# Altium schematic sheet Sheet1.SchDoc
size A3; SheetNumber: 1; SheetTotal: 1
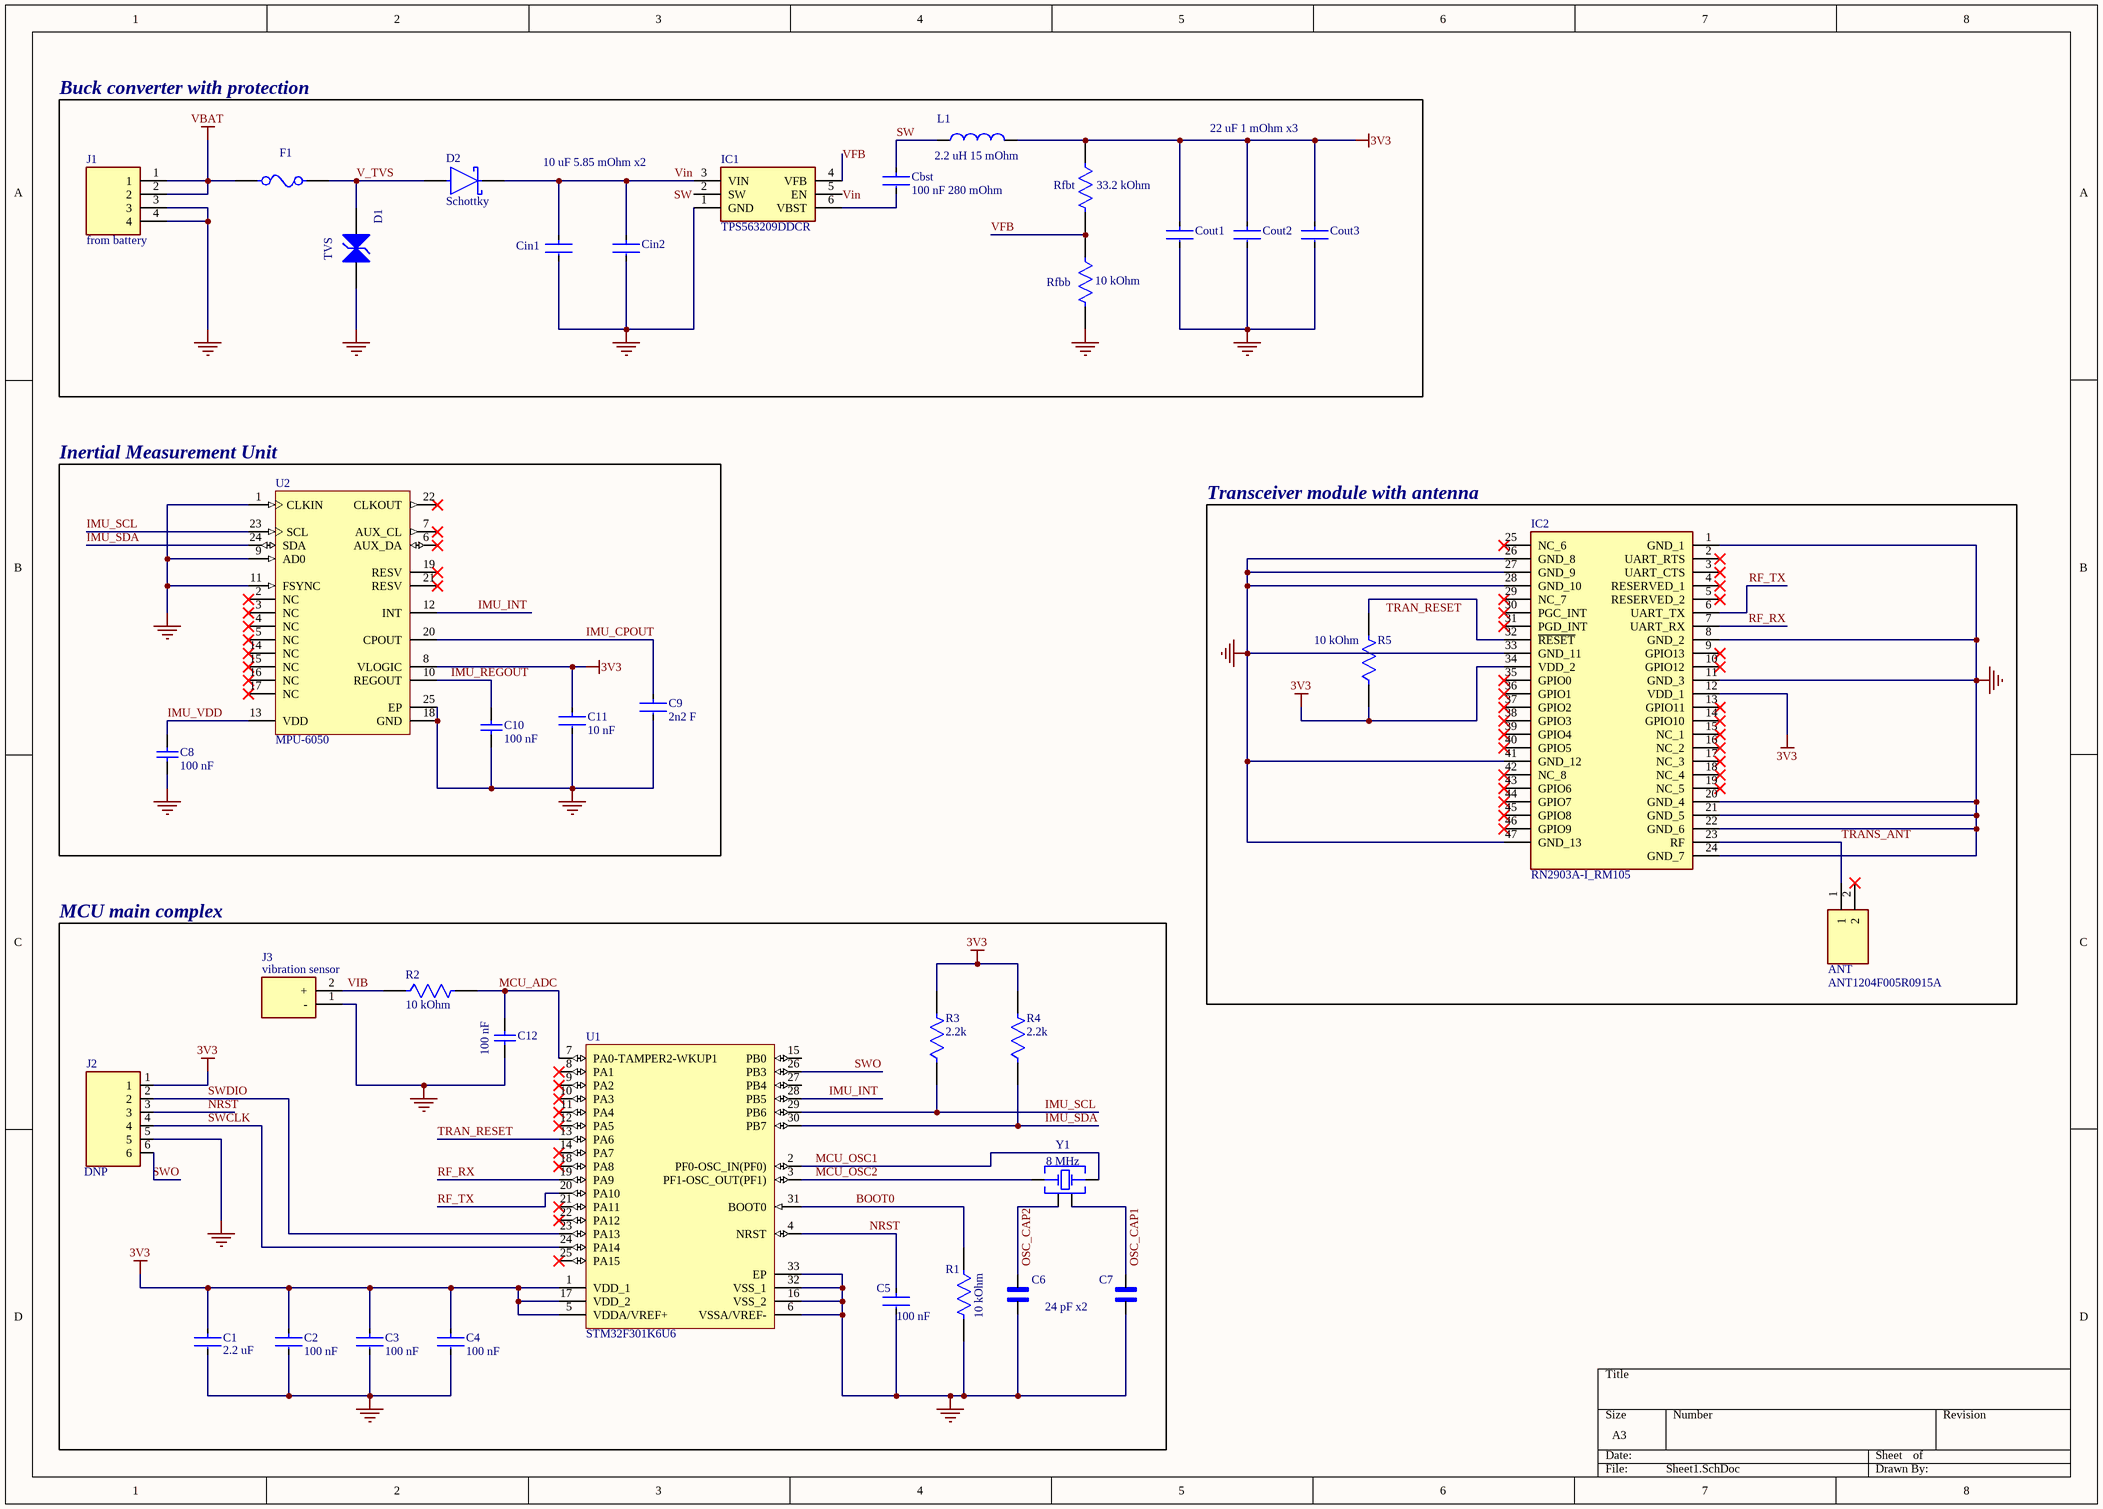
[diagram p0: Sheet1.SchDoc]

## Parts
ANT  ANT1204F005R0915A  [ANT1204F005R0915A]
C1  2.2 uF  [FP-GRM21B-0_2-e0_2_0_7-IPC_B]
C2  100 nF  [FP-GCE21B-0_3-MFG]
C3  100 nF  [FP-GCE21B-0_3-MFG]
C4  100 nF  [FP-GCE21B-0_3-MFG]
C5  100 nF  [FP-GCE21B-0_3-MFG]
C6  CC0402JRNPO9BN240  [CAPC1005X55N]  (value not drawn)
C7  24 pF x2  [CAPC1005X55N]
C8  100 nF  [CAPC1005X55X30NL05T10]
C9  2n2 F  [FP-CC0402-MFG]
C10  100 nF  [CAPC1005X55X30NL05T10]
C11  10 nF  [FP-0402-L_1_0_0_05-W_0_5-IPC_A]
C12  100 nF  [CAPC1005X55X30NL05T10]
Cbst  100 nF 280 mOhm  [FP-GCE21B-0_3-MFG]
Cin1  10 uF 5.85 mOhm x2  [FP-GRM21B-0_1-IPC_B]
Cin2  10 uF 5.85 mOhm  [FP-GRM21B-0_1-IPC_B]  (value not drawn)
Cout1  22 uF 1 mOhm x3  [FP-GRM319-0_15-IPC_B]
Cout2  22uF 1 mOhm  [FP-GRM319-0_15-IPC_B]  (value not drawn)
Cout3  22uF 1 mOhm  [FP-GRM319-0_15-IPC_B]  (value not drawn)
D1  TVS  [WE-TVSP_DO-214AA_Bidirectional]
D2  Schottky  [FP-DO-214BA-MFG]
F1  Fuse  [FP-OMF_63-MFG]  (value not drawn)
IC1  TPS563209DDCR  [SOT95P280X110-6N]
IC2  RN2903A-I_RM105  [RN2903AIRM105]
J1  from battery  [13791657]
J2  DNP  [TAG_TC2030-IDC-NL]
J3  vibration sensor  [10059401]
L1  2.2 uH 15 mOhm  [WE-PMFI_322512]
R1  10 kOhm  [FP-AT0402-IPC_A]
R2  10 kOhm  [FP-AT0402-IPC_A]
R3  2.2k  [FP-RT0402-MFG]
R4  2.2k  [FP-RT0402-MFG]
R5  10 kOhm  [FP-AT0402-IPC_A]
Rfbb  10 kOhm  [FP-AT0402-IPC_A]
Rfbt  33.2 kOhm  [FP-AF0402-IPC_B]
U1  STM32F301K6U6  [STM-UFQFPN32_L]
U2  MPU-6050  [IS-QFN-24_V]
Y1  8 MHz  [WE-XTAL_12SMX]

## Blocks framed on the sheet
Buck converter with protection: Cbst Cin1 Cin2 Cout1-Cout3 D1 D2 F1 IC1 J1 L1 Rfbb Rfbt
Inertial Measurement Unit: C8-C11 U2
Transceiver module with antenna: ANT IC2 R5
MCU main complex: C1-C7 C12 J2 J3 R1-R4 U1 Y1

## Nets
3V3: C1.1 C2.1 C3.1 C4.1 C11.1 Cout1.1 Cout2.1 Cout3.1 IC2.12(VDD_1) IC2.34(VDD_2) J2.1 L1.2 R3.2 R4.2 R5.1 Rfbt.1 U1.1(VDD_1) U1.5(VDDA/VREF+) U1.17(VDD_2) U2.8(VLOGIC)
GND: C1.2 C2.2 C3.2 C4.2 C5.2 C6.2 C7.2 C8.1 C9.2 C10.1 C11.2 C12.1 Cin1.2 Cin2.2 Cout1.2 Cout2.2 Cout3.2 D1.2 IC1.1(GND) IC2.1(GND_1) IC2.8(GND_2) IC2.11(GND_3) IC2.20(GND_4) IC2.21(GND_5) IC2.22(GND_6) IC2.24(GND_7) IC2.26(GND_8) IC2.27(GND_9) IC2.28(GND_10) IC2.33(GND_11) IC2.41(GND_12) IC2.47(GND_13) J1.3 J1.4 J2.5 J3.1(-) R1.2 Rfbb.2 U1.6(VSSA/VREF-) U1.16(VSS_2) U1.32(VSS_1) U1.33(EP) U2.1(CLKIN) U2.9(AD0) U2.11(FSYNC) U2.18(GND) U2.25(EP)
VBAT: F1.1 J1.1 J1.2
BOOT0: R1.1 U1.31(BOOT0)
IMU_CPOUT: C9.1 U2.20(CPOUT)
IMU_INT: U1.28(PB5) U2.12(INT)
IMU_REGOUT: C10.2 U2.10(REGOUT)
IMU_SCL: R3.1 U1.29(PB6) U2.23(SCL)
IMU_SDA: R4.1 U1.30(PB7) U2.24(SDA)
IMU_VDD: C8.2 U2.13(VDD)
MCU_ADC: C12.2 R2.2 U1.7(PA0-TAMPER2-WKUP1)
MCU_OSC1: U1.2(PF0-OSC_IN(PF0)) Y1.1(Crystal)
MCU_OSC2: U1.3(PF1-OSC_OUT(PF1)) Y1.3(Crystal)
NRST: C5.1 J2.3 U1.4(NRST)
OSC_CAP1: C7.1 Y1.2(GND)
OSC_CAP2: C6.1 Y1.4(GND)
RF_RX: IC2.7(UART_RX) U1.19(PA9)
RF_TX: IC2.6(UART_TX) U1.20(PA10)
SW: Cbst.1 IC1.2(SW) L1.1
SWCLK: J2.4 U1.24(PA14)
SWDIO: J2.2 U1.23(PA13)
SWO: J2.6 U1.26(PB3)
TRAN_RESET: IC2.32(~{RESET}) R5.2 U1.13(PA6)
TRANS_ANT: ANT.1 IC2.23(RF)
V_TVS: D1.1 D2.2(A) F1.2
VFB: IC1.4(VFB) Rfbb.1 Rfbt.2
VIB: J3.2(+) R2.1
Vin: Cin1.1 Cin2.1 D2.1(C) IC1.3(VIN) IC1.5(EN)
NetCbst_2: Cbst.2 IC1.6(VBST)

Not connected (* = marked no-connect by the designer): ANT 2*; IC2 2(UART_RTS)* 3(UART_CTS)* 4(RESERVED_1)* 5(RESERVED_2)* 9(GPIO13)* 10(GPIO12)* 13(GPIO11)* 14(GPIO10)* 15(NC_1)* 16(NC_2)* 17(NC_3)* 18(NC_4)* 19(NC_5)* 25(NC_6)* 29(NC_7)* 30(PGC_INT)* 31(PGD_INT)* 35(GPIO0)* 36(GPIO1)* 37(GPIO2)* 38(GPIO3)* 39(GPIO4)* 40(GPIO5)* 42(NC_8)* 43(GPIO6)* 44(GPIO7)* 45(GPIO8)* 46(GPIO9)*; U1 8(PA1)* 9(PA2)* 10(PA3)* 11(PA4)* 12(PA5)* 14(PA7)* 15(PB0) 18(PA8)* 21(PA11)* 22(PA12)* 25(PA15)* 27(PB4); U2 2(NC)* 3(NC)* 4(NC)* 5(NC)* 6(AUX_DA)* 7(AUX_CL)* 14(NC)* 15(NC)* 16(NC)* 17(NC)* 19(RESV)* 21(RESV)* 22(CLKOUT)*

## Library data of the parts
ANT = ANT1204F005R0915A: Antenna; Manufacturer_Name: Yageo Group; Datasheet Link: https://eu.mouser.com/datasheet/2/447/datasheet_pulse_915mhz_1204_chip_antenna_type05_an-2903025.pdf; Height: 1.8mm; Manufacturer_Part_Number: ANT1204F005R0915A; Mouser Part Number: 603-ANT1204F005R0915; Mouser Price/Stock: https://www.mouser.co.uk/ProductDetail/PulseLarsen-Antennas/ANT1204F005R0915A?qs=gt1LBUVyoHnk%2Fihas5MohQ%3D%3D; Arrow Part Number: ANT1204F005R0915A; Arrow Price/Stock: https://www.arrow.com/en/products/ant1204f005r0915a/yageo
C1 = CMP-06035-063309-1: CAP CER 2.2UF 100V X7T 0805
C2-C5 Cbst = CMP-06035-010744-1: Ceramic Capacitor 100nF ±20% 100V X7R 0805
C6 C7 = CC0402JRNPO9BN240: 24 pF Â±5% 50V Ceramic Capacitor C0G, NP0 0402 (1005 Metric); MF: Yageo; SnapEDA_Link: https://www.snapeda.com/parts/CC0402JRNPO9BN240/Yageo/view-part/?ref=snap; Package: 0402 Yageo; Value: *; MP: CC0402JRNPO9BN240; Check_prices: https://www.snapeda.com/parts/CC0402JRNPO9BN240/Yageo/view-part/?ref=eda
C8 C10 C12 = CMP-2008-03089-1: Manufacturer: Kemet; Part Number: C0402C104Z8VACTU
C9 = CMP-03422-001301-1: CAP CER 2200PF 10V X7R 0402; Manufacturer Part Number: CC0402MRX7R6BB222; Manufacturer: YAGEO; Capacitance: 2.2 nF; Temperature Coefficient: 30ppm/°C; Value: 2.2 nF; Tolerance: 0.2; Material: Ceramic; Automotive Grade: NA; Temperature Range Low: -55°C; Automotive: No; Digikey Description: CAP CER 2200PF 10V X7R 0402; Category: Cap; Octopart: https://octopart.com/cc0402mrx7r6bb222-yageo-71334383; RoHS: TRUE; Device Class L3: Ceramic Capacitors; Lead Free: Yes; Voltage Rating: 10 V; ComponentLink2Description: Datasheet; Temperature: -55°C to +125°C; Package: CC0402; Mouser Description: Multilayer Ceramic Capacitors MLCC - SMD/SMT 2.2nF 10V X7R 20%; Footprint Url: http://www.yageo.com/exep/pages/download/literatures/UPY-C_GEN_24.pdf; Device Class L2: Capacitors; Temperature Range High: +125°C; Device Class L1: Passive Components; Height: 0.55mm; Ipc Land Pattern Name: CAPC10050X50; ComponentLink2URL: http://www.yageo.com/documents/recent/UPY-GP_NP0_16V-to-50V_16.pdf; Temperature Characteristic: X7R
C11 = CMP-14477-001757-2: None
Cin1 Cin2 = CMP-2007-03502-2: Chip Multilayer Ceramic Capacitors for General Purpose, 0805, 10uF, X6S, 22%, 20%, 10V; Packaging: Tape and Reel; Case/Package: 0805; Length: 2mm; Construction: Flat; Termination: SMD/SMT; Width: 1.25mm; Dielectric: X6S; Voltage Rating (DC): 10V; Voltage Rating: 10V; Case Code (Imperial): 0805; Capacitance: 10uF; Height: 1.25mm; Depth: 1.25mm; Min Operating Temperature: -55°C; Max Operating Temperature: 105°C; Thickness: 0.053inch; Tolerance: 20%; Package Quantity: 3000; Radiation Hardening: No; Mount: Surface Mount; Case Code (Metric): 2012; Series: GRM
Cout1-Cout3 = CMP-06035-054235-1: Chip Multilayer Ceramic Capacitors for General Purpose, 1206, 22uF, X5R, 15%, 10%, 16V; Tolerance: 10%; Dielectric: X5R; Width: 1.6mm; Thickness: 850um; Voltage Rating (DC): 16V; Capacitance: 22uF; Length: 3.2mm
D1 = CMP-03913-73414981-2: TVS diode [Würth Elektronik] 824521181 TVS diode; Leakage Current: 1µA; Reverse Standoff Voltage: 18V; Peak Pulse Power: 600W; Max Breakdown Voltage: 21.05V; Clamping Voltage: 29.2V; Polarity: Bidirectional; Height: 2.4mm; Max Operating Temperature: 150°C; RoHS: Compliant; Length: 4.32mm; Packaging: Cut Tape; Width: 3.62mm; Min Operating Temperature: -65°C; REACH SVHC: Unknown; Breakdown Voltage: 21.05V; Number of Pins: 2
D2 = CMP-00252-99180384-1: HSM160JE3/TR13 Schottky 1.0A, 60V, Vf=0.60V Smcj (Do-214Ab) Rohs Compliant: Yes; Forward Voltage: 690mV; Peak Reverse Current: 100µA; Element Configuration: Single; Peak Non-Repetitive Surge Current: 50A; Capacitance: 53pF; Average Rectified Current: 1A; Max Junction Temperature (Tj): 175°C; Max Operating Temperature: 175°C; Min Operating Temperature: -55°C; Max Reverse Voltage (DC): 60V; Reverse Voltage: 60V; RoHS: Compliant; Forward Current: 1A; NexarPartId: 99180384; Mount: Surface Mount; Packaging: Tape and Reel; Height: 3.3mm; Radiation Hardening: No; Max Repetitive Reverse Voltage (Vrrm): 60V; Schedule B: 8541100080; Number of Pins: 2; Max Forward Surge Current (Ifsm): 50A
F1 = CMP-26293-000004-1: FUSE BOARD MNT 5A 63VAC/VDC 2SMD; Manufacturer Part Number: 3402.0017.11; Manufacturer: Schurter Inc; Max Fuse Dc Voltage: 63V; Fuse I2T: 2.9A2Sec; Fuse Blow Speed: Fast; Fuse Voltage Drop: 140mV; RoHS: TRUE; Device Class L3: unset; Octopart: https://octopart.com/3402.0017.11-schurter-563471; Lead Free: Yes; Ambient Temperature Range Low: -40°C; Mouser Description: Surface Mount Fuses OMF 63V 5A; Height: 2.6mm; ComponentLink2URL: https://www.schurter.com/en/datasheet/typ_OMF_63.pdf; Package: OMF_63; Voltage Rating: 63V; Device Class L1: Circuit Protection; Ambient Temperature Range High: +125°C; Digikey Description: FUSE BOARD MNT 5A 63VAC/VDC 2SMD; Automotive: No; Fuse Current: 5A; Device Class L2: Fuses; ComponentLink2Description: Datasheet; Category: Fuse; Max Fuse Ac Voltage: 63V
IC1 = CMP-031-00007-1: 17 V Input; Manufacturer_Name: Texas Instruments; Mouser Price/Stock: https://www.mouser.co.uk/ProductDetail/Texas-Instruments/TPS563209DDCR?qs=bT6MOr62zwIer%2FLlyIAhvQ%3D%3D; Datasheet Link: http://www.ti.com/lit/gpn/tps563209; Design Item ID: TPS563209DDCR; Mouser Part Number: 595-TPS563209DDCR; Arrow Part Number: TPS563209DDCR; Arrow Price/Stock: https://www.arrow.com/en/products/tps563209ddcr/texas-instruments.html?utm_currency=USD&region=nac; Manufacturer_Part_Number: TPS563209DDCR; Height: 1.1mm; Source: SamacSys.SchLib
IC2 = RN2903A-I_RM105: Integrated Circuit; Manufacturer_Name: Microchip; Manufacturer_Part_Number: RN2903A-I/RM105; Datasheet Link: http://ww1.microchip.com/downloads/en/DeviceDoc/RN2903-LoRa-Technology-Transceiver-Module-Data-Sheet-DS50002390G.pdf; Height: 3.34mm; Mouser Part Number: 579-RN2903A-I/RM105; Mouser Price/Stock: https://www.mouser.co.uk/ProductDetail/Microchip-Technology/RN2903A-I-RM105?qs=PqoDHHvF648ggy%252BxQbPa3A%3D%3D; Arrow Part Number: RN2903A-I/RM105; Arrow Price/Stock: https://www.arrow.com/en/products/rn2903a-irm105/microchip-technology?utm_currency=USD&region=nac
J1 = 1379165-7: Connector; Manufacturer_Name: TE Connectivity; Datasheet Link: https://www.mouser.de/datasheet/2/418/6/ENG_CD_1379165_D5-2005008.pdf; Height: 18.8mm; Manufacturer_Part_Number: 1379165-7; Mouser Part Number: 571-1379165-7; Mouser Price/Stock: https://www.mouser.co.uk/ProductDetail/TE-Connectivity-AMP/1379165-7?qs=6Z%252BHCgJKjncEStSYB7eeFQ%3D%3D; Arrow Part Number: 1379165-7; Arrow Price/Stock: https://www.arrow.com/en/products/1379165-7/te-connectivity
J2 = CMP-009-000001-1: CABLE ADAPTER 6 POS; Design Item ID: TC2030-IDC-NL; Value: *; Price: None; Pin Count: 6; Package: None; Component Type: Standard; Availability: Unavailable; Source: TC2030-IDC-NL.SchLib; MP: TC2030-IDC-NL
J3 = CMP-002-00073-1: Connector; Manufacturer_Name: TE Connectivity; Manufacturer_Part_Number: 1005940-1; Arrow Price/Stock: https://www.arrow.com/en/products/1005940-1/te-connectivity; Datasheet Link: https://www.te.com/en/product-1005940-1.html; Mouser Part Number: 824-1005940-1; Height: 3mm; Design Item ID: 1005940-1; Mouser Price/Stock: https://www.mouser.co.uk/ProductDetail/Measurement-Specialties/1005940-1?qs=nNyf8ckWk3QltpLrvr%2FUIQ%3D%3D; Source: SamacSys.SchLib; Arrow Part Number: 1005940-1
L1 = CMP-03913-162350128-1: Power Ind, 2.2UH, 4.1A, Shielded, 1210 Rohs Compliant: Yes
R1 R2 R5 Rfbb = CMP-03412-043449-1: Thin Film Chip Resistors Automotive Grade 10kΩ 0.5% 25ppm/°C 0402; Resistance: 10kR; Max Power Dissipation: 63mW; Tolerance: 0.5%; Temperature Coefficient: 25ppm/°C; Width: 0.02inch; RoHS Compliant: Yes; Min Operating Temperature: -55°C; Height: 0.014inch; Case Code (Metric): 1005; Ratings: AEC-Q200; Case/Package: 0402; Max Operating Temperature: 155°C; Number of Terminations: 2; Features: Moisture Resistant; Packaging: Cut Tape; Length: 0.039inch; Series: AT; Resistor Type: Thin Film; Case Code (Imperial): 0402
R3 R4 = CMP-03412-019720-1: RES SMD 2.2K OHM 0.1% 1/16W 0402; Manufacturer: Yageo; Manufacturer Part Number: RT0402BRE072K2L; Power Rating: 0.063W; Temperature Coefficient: 50 ppm/°C; Value: 2.2KΩ; Tolerance: 0.001; Voltage Rating: 50V; ComponentLink2URL: http://www.yageo.com/documents/recent/PYu-RT_1-to-0.01_RoHS_L_9.pdf; RoHS: TRUE; Device Class L3: Chip SMD Resistors; Category: Res; Ipc Land Pattern Name: RESC10050X30; Series: RT; Lead Free: Yes; Device Class L1: Passive Components; Temperature Range Low: -55°C; Package: RT0402; Automotive: No; Octopart: https://octopart.com/rt0402bre072k2l-yageo-1445889; Temperature: -55°C to +155°C; Footprint Url: http://www.yageo.com/exep/pages/download/literatures/PYu-R_Mount_10.pdf; Composition: Thin Film; Resistance: 2.2KΩ; Temperature Range High: +155°C; Digikey Description: RES SMD 2.2K OHM 0.1% 1/16W 0402; Device Class L2: Resistors; ComponentLink2Description: Datasheet; Height: 0.35mm
Rfbt = CMP-03412-045433-1: Anti-Sulfurated Chip Resistors Automotive Grade 33.2kΩ 1% 100ppm/°C 0402; Resistance: 33.2kR; Max Power Dissipation: 63mW; Length: 0.039inch; Tolerance: 1%; Case/Package: 0402; Packaging: Tape and Reel; Resistor Type: Thick Film; Series: AF; Features: Moisture Resistant; Temperature Coefficient: 100ppm/°C; Max Operating Temperature: 155°C; Number of Terminations: 2; Min Operating Temperature: -55°C; Height: 0.015inch; Width: 0.02inch; RoHS Compliant: Yes
U1 = CMP-0537-00004-1: ARM Cortex-M4 32-bit MCU, 32 KB Flash, 16 KB Internal RAM, 24 I/Os, 32-Pin UFQFPN, -40 to 85 degC, Tray; I/Os (High Current): 24; Supply Voltage(Vcc) min (V): 2; Operating Frequency(F) (Processor speed) (MHz): 72; D/A Converter: 1; FLASH Size (Prog) (kB): 32; Internal RAM Size (kB): 16; Package Reference: UFQFPN32; Package Description: 32-Pin Ultra Thin Fine Pitch Quad Flat No-Lead, 5 x 5 x 0.6 mm Body, 0.5 mm Pitch, Exposed Pad 3.5 x 3.5 mm; Mounting Technology: Surface Mount; ComponentLink1Description: Manufacturer URL; ComponentLink2Description: Datasheet; ComponentLink2URL: http://www.st.com/st-web-ui/static/active/en/resource/technical/document/datasheet/DM00093332.pdf; ComponentLink1URL: http://www.st.com/; Packing: Tray; DatasheetVersion: Rev. 6; Core: ARM Cortex-M4
U2 = CMP-1753-00002-2: 3-Axis Gyroscope, Accelerometer and a Digital Motion Processor(TM) (DMP), 2.375 to 3.46 V, -40 to 85 degC, 24-Pin QFN, RoHS, Tape and Reel; Manufacturer: InvenSense; Featured Product: MPU-60506-Axis,IntegratedI²CSolution; Other Names: 1428-1007-2 / MPU6050; Sensor Type: MotionTracking; Online Catalog: MPU-6000™Series; Unit PriceUSD: Digital; Datasheet Version: Rev. 3.3, 05/2012; Category: Sensors,Transducers; Datasheet URL: http://datasheet.octopart.com/MPU-6050-InvenSense-datasheet-14421344.pdf; Family: Multifunction; Standard Package: 5,000; Manufacturer URL: http://www.invensense.com/; Output Type: Digital; Dynamic Catalog: MPU-6000™Series
Y1 = CMP-03913-116855642-2: WE-XTAL Quartz Crystal; Frequency: 8MHz; Min Operating Temperature: -20°C; Length: 7mm; Height: 1.4mm; Max Operating Temperature: 70°C; Width: 5mm